# EAGLE schematic mems_quart_board_ics_40720 (EAGLE 7.6.0)
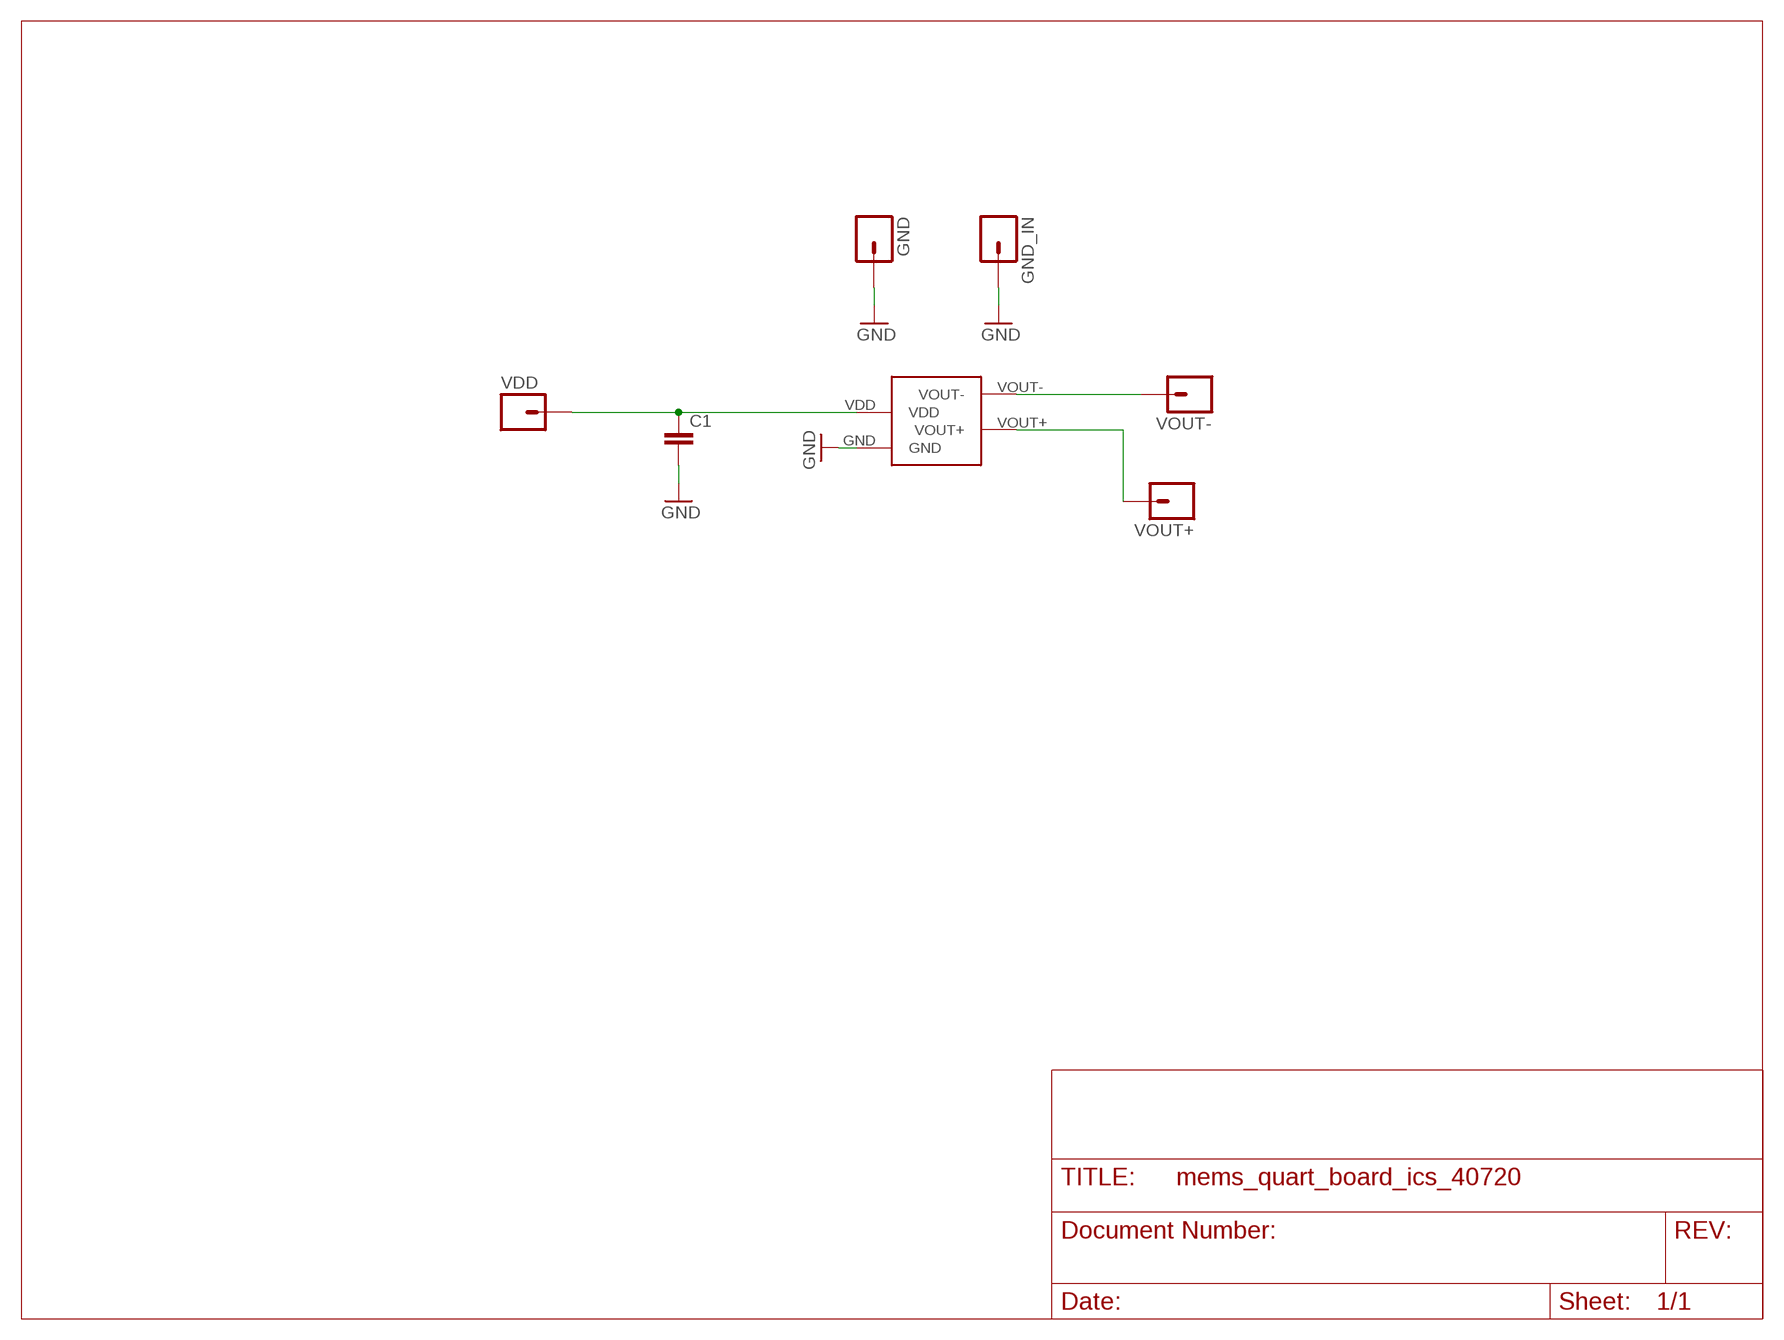
[diagram p0: schematic, sheet 1]

## Parts
C1  0.1UF-16V(+-10%)(0402)  [0402-CAP]
GND  M01PTH_NO_SILK_YES_STOP  [1X01_NO_SILK]
GND_IN  M01NOSILK-KIT  [1X01NS-KIT]
U$1  MEMS_ICS_40720  [ MEMS_ICS_40720]
VDD  M01NOSILK-KIT  [1X01NS-KIT]
VOUT+  M01NOSILK-KIT  [1X01NS-KIT]
VOUT-  M01NOSILK-KIT  [1X01NS-KIT]

## Nets
GND: C1.2 GND.1 GND_IN.1 U$1.GND
VDD: C1.1 U$1.VDD VDD.1
VOUT+: U$1.VOUT+ VOUT+.1
VOUT-: U$1.VOUT- VOUT-.1

## Library data of the parts
C1 = SparkFun-Capacitors:0.1UF-16V(+-10%)(0402); PROD_ID: CAP-12416; VALUE: 0.1uF
GND = CM-SparkFun-Connectors-large_hole:M01: Header 1 Standard 1-pin 0.1" header. Use with straight break away headers (SKU : PRT-00116), right angle break away headers (PRT-00553), swiss pins (PRT-00743), machine pins (PRT-00117), and female headers (PRT-00115). SMTSO-256-ET is a "flush mount" nut for a 4-40 screw. The older package used to be too tight, and did not allow it to sit properly thru the drill hit. The latest (0.165DIA) fits nice and snug.
GND_IN VDD VOUT+ VOUT- = CM-SparkFun-Connectors:M01: Header 1 Standard 1-pin 0.1" header. Use with straight break away headers (SKU : PRT-00116), right angle break away headers (PRT-00553), swiss pins (PRT-00743), machine pins (PRT-00117), and female headers (PRT-00115). SMTSO-256-ET is a "flush mount" nut for a 4-40 screw. The older package used to be too tight, and did not allow it to sit properly thru the drill hit. The latest (0.165DIA) fits nice and snug.
U$1 = mems_ICS_40720: MEMS_ICS_40720

## Net classes
0 default: clearance 0.205 mm